# Altium schematic sheet 01_Overview.SchDoc
size A4; Revision: B; SheetNumber: 2; SheetTotal: 7
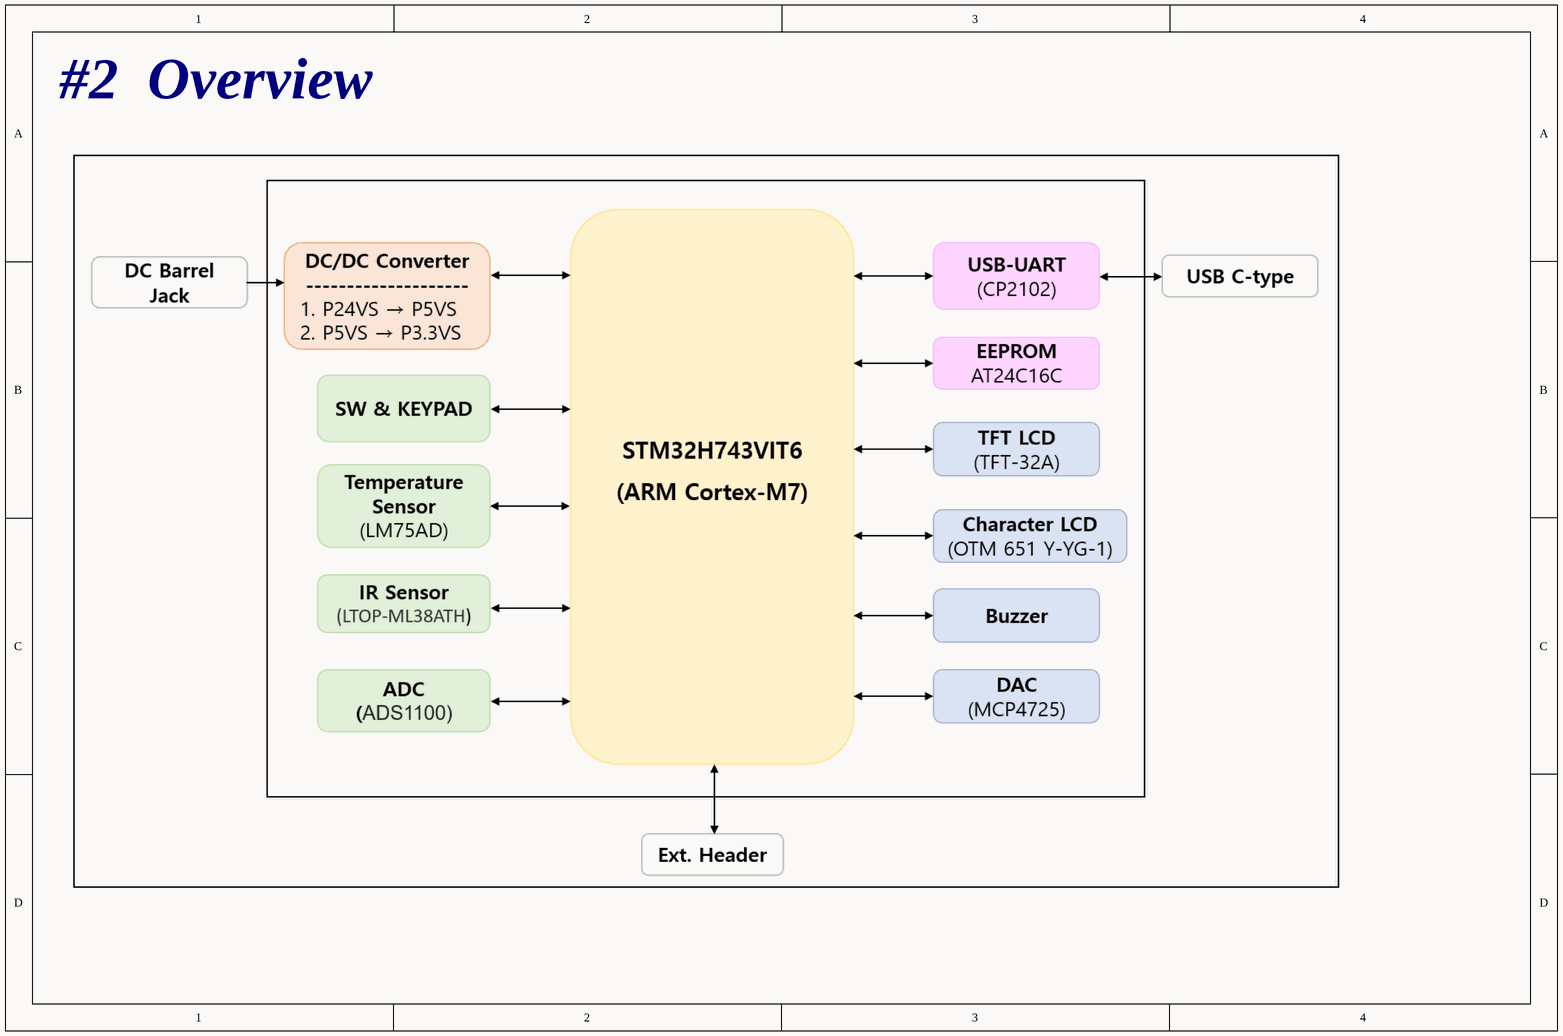
[diagram p0: 01_Overview.SchDoc]

## Notes on the sheet
- #2  Overview
- Title
- Rev
- Doc
- Sheet #
- of
- Author
- This document is copyright of ArkX and shall not be revealed, produced, copied, in whole or in part,
- Date
- ©2024
- nor used for any purpose other than submitted.